# Altium project EPROM_Programmer.PrjPcb
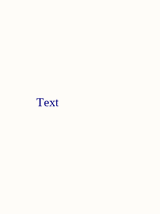
[diagram p0: EPROM_Programmer.SchDoc, left]
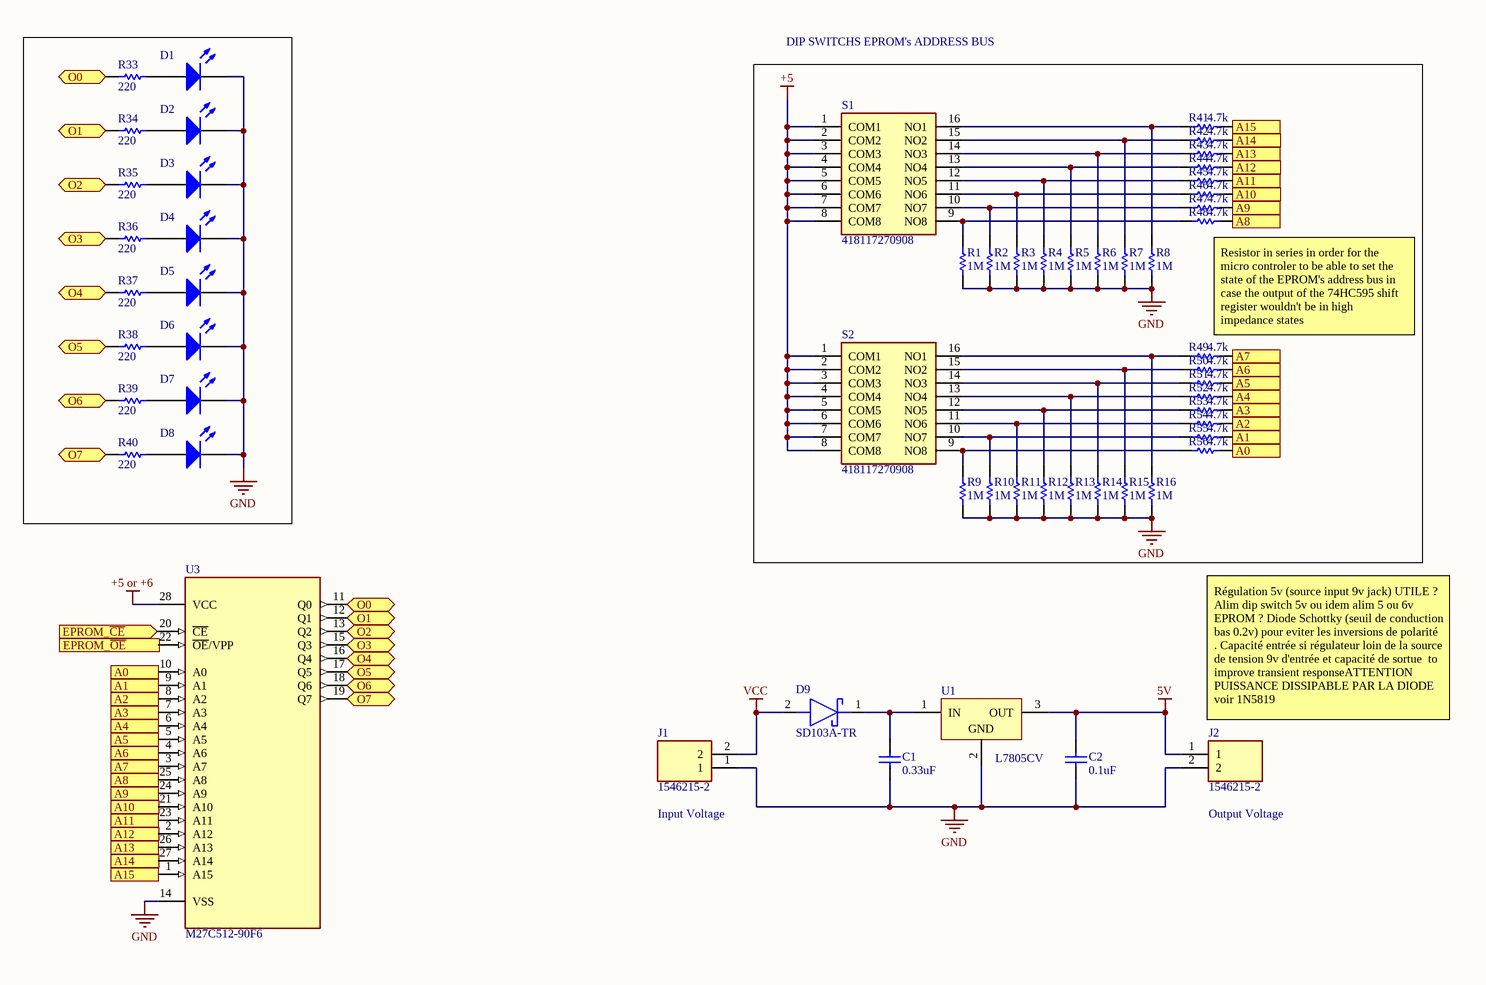
[diagram p1: EPROM_Programmer.SchDoc, right]
3 sheets, 109 parts. Net scope: flat (ports and power ports of the same name join across sheets).
Board file: EPROM_Programmer.PcbDoc
Sheets:
  EPROM_Programmer.SchDoc
  EPROM_Programmer_2.SchDoc
  EPROM_Programmer_3.SchDoc

## Sheet EPROM_Programmer.SchDoc: EPROM MANUAL PROGRAMMER
size A4; Author: L.JAOUANNE; Revision: v1.0; SheetNumber: 1; SheetTotal: 3

### Parts
C1  0.33uF  [C0603]
C2  0.1uF  [C0603]
D1  LED_SMD  [0603_LED]  (value not drawn)
D2  LED_SMD  [0603_LED]  (value not drawn)
D3  LED_SMD  [0603_LED]  (value not drawn)
D4  LED_SMD  [0603_LED]  (value not drawn)
D5  LED_SMD  [0603_LED]  (value not drawn)
D6  LED_SMD  [0603_LED]  (value not drawn)
D7  LED_SMD  [0603_LED]  (value not drawn)
D8  LED_SMD  [0603_LED]  (value not drawn)
D9  SD103A-TR  [DIOAD950W60L350D150]
J1  1546215-2  [15462152]
J2  1546215-2  [15462152]
R1  value 1M  [R0603]  (hidden comment: Res1)
R2  value 1M  [R0603]  (hidden comment: Res1)
R3  value 1M  [R0603]  (hidden comment: Res1)
R4  value 1M  [R0603]  (hidden comment: Res1)
R5  value 1M  [R0603]  (hidden comment: Res1)
R6  value 1M  [R0603]  (hidden comment: Res1)
R7  value 1M  [R0603]  (hidden comment: Res1)
R8  value 1M  [R0603]  (hidden comment: Res1)
R9  value 1M  [R0603]  (hidden comment: Res1)
R10  value 1M  [R0603]  (hidden comment: Res1)
R11  value 1M  [R0603]  (hidden comment: Res1)
R12  value 1M  [R0603]  (hidden comment: Res1)
R13  value 1M  [R0603]  (hidden comment: Res1)
R14  value 1M  [R0603]  (hidden comment: Res1)
R15  value 1M  [R0603]  (hidden comment: Res1)
R16  value 1M  [R0603]  (hidden comment: Res1)
R33  value 220  [R0603]  (hidden comment: Res1)
R34  value 220  [R0603]  (hidden comment: Res1)
R35  value 220  [R0603]  (hidden comment: Res1)
R36  value 220  [R0603]  (hidden comment: Res1)
R37  value 220  [R0603]  (hidden comment: Res1)
R38  value 220  [R0603]  (hidden comment: Res1)
R39  value 220  [R0603]  (hidden comment: Res1)
R40  value 220  [R0603]  (hidden comment: Res1)
R41  value 4.7k  [R0603]  (hidden comment: Res1)
R42  value 4.7k  [R0603]  (hidden comment: Res1)
R43  value 4.7k  [R0603]  (hidden comment: Res1)
R44  value 4.7k  [R0603]  (hidden comment: Res1)
R45  value 4.7k  [R0603]  (hidden comment: Res1)
R46  value 4.7k  [R0603]  (hidden comment: Res1)
R47  value 4.7k  [R0603]  (hidden comment: Res1)
R48  value 4.7k  [R0603]  (hidden comment: Res1)
R49  value 4.7k  [R0603]  (hidden comment: Res1)
R50  value 4.7k  [R0603]  (hidden comment: Res1)
R51  value 4.7k  [R0603]  (hidden comment: Res1)
R52  value 4.7k  [R0603]  (hidden comment: Res1)
R53  value 4.7k  [R0603]  (hidden comment: Res1)
R54  value 4.7k  [R0603]  (hidden comment: Res1)
R55  value 4.7k  [R0603]  (hidden comment: Res1)
R56  value 4.7k  [R0603]  (hidden comment: Res1)
S1  418117270908  [DIPS762W60P254L2132H695Q16N]
S2  418117270908  [DIPS762W60P254L2132H695Q16N]
U1  L7805CV  [TO254P1054X470X1955-3]
U3  M27C512-90F6  [DIP254P1524X572-28]

### Blocks framed on the sheet
DIP SWITCHS EPROM's ADDRESS BUS: R1-R16 R41-R56 S1 S2

### Ports
A0 (in, see EPROM_Programmer[4B], EPROM_Programmer_3[1C]), A0 (out, see EPROM_Programmer[1C], EPROM_Programmer_3[1C]), A1 (in, see EPROM_Programmer[4B], EPROM_Programmer_3[1C]), A1 (out, see EPROM_Programmer[1C], EPROM_Programmer_3[1C]), A2 (in, see EPROM_Programmer[4B], EPROM_Programmer_3[1C]), A2 (out, see EPROM_Programmer[1C], EPROM_Programmer_3[1C]), A3 (in, see EPROM_Programmer[4B], EPROM_Programmer_3[1C]), A3 (out, see EPROM_Programmer[1C], EPROM_Programmer_3[1C]), A4 (in, see EPROM_Programmer[4B], EPROM_Programmer_3[1C]), A4 (out, see EPROM_Programmer[1C], EPROM_Programmer_3[1C]), A5 (in, see EPROM_Programmer[4B], EPROM_Programmer_3[1C]), A5 (out, see EPROM_Programmer[1C], EPROM_Programmer_3[1C]), A6 (in, see EPROM_Programmer[4B], EPROM_Programmer_3[1C]), A6 (out, see EPROM_Programmer[1D], EPROM_Programmer_3[1C]), A7 (in, see EPROM_Programmer[4B], EPROM_Programmer_3[1C]), A7 (out, see EPROM_Programmer[1D], EPROM_Programmer_3[1C]), A8 (in, see EPROM_Programmer[4A], EPROM_Programmer_3[2D]), A8 (out, see EPROM_Programmer[1D], EPROM_Programmer_3[2D]), A9 (in, see EPROM_Programmer[4A], EPROM_Programmer_3[1D]), A9 (out, see EPROM_Programmer[1D], EPROM_Programmer_3[1D]), A10 (in, see EPROM_Programmer[4A], EPROM_Programmer_3[1D]), A10 (out, see EPROM_Programmer[1D], EPROM_Programmer_3[1D]), A11 (in, see EPROM_Programmer[4A], EPROM_Programmer_3[1D]), A11 (out, see EPROM_Programmer[1D], EPROM_Programmer_3[1D]), A12 (in, see EPROM_Programmer[4A], EPROM_Programmer_3[1D]), A12 (out, see EPROM_Programmer[1D], EPROM_Programmer_3[1D]), A13 (in, see EPROM_Programmer[4A], EPROM_Programmer_3[1D]), A13 (out, see EPROM_Programmer[1D], EPROM_Programmer_3[1D]), A14 (in, see EPROM_Programmer[4A], EPROM_Programmer_3[1D]), A14 (out, see EPROM_Programmer[1D], EPROM_Programmer_3[1D]), A15 (in, see EPROM_Programmer[4A], EPROM_Programmer_3[1D]), A15 (out, see EPROM_Programmer[1D], EPROM_Programmer_3[1D]), EPROM_~{CE} (in, see EPROM_Programmer_2[4B]), EPROM_~{OE} (in, see EPROM_Programmer_3[4A]), O0 (bidir, see EPROM_Programmer[1A]), O0 (bidir, see EPROM_Programmer[2C]), O1 (bidir, see EPROM_Programmer[1A]), O1 (bidir, see EPROM_Programmer[2C]), O2 (bidir, see EPROM_Programmer[1A]), O2 (bidir, see EPROM_Programmer[2C]), O3 (bidir, see EPROM_Programmer[1A]), O3 (bidir, see EPROM_Programmer[2C]), O4 (bidir, see EPROM_Programmer[1B]), O4 (bidir, see EPROM_Programmer[2C]), O5 (bidir, see EPROM_Programmer[1B]), O5 (bidir, see EPROM_Programmer[2C]), O6 (bidir, see EPROM_Programmer[1B]), O6 (bidir, see EPROM_Programmer[2C]), O7 (bidir, see EPROM_Programmer[1B]), O7 (bidir, see EPROM_Programmer[2C])

### Nets
5V: C2.1 J2.1 U1.3(OUT)
+5: C1.2 C2.2 D1.2(K) D2.2(K) D3.2(K) D4.2(K) D5.2(K) D6.2(K) D7.2(K) D8.2(K) J1.1 J2.2 R1.2 R2.2 R3.2 R4.2 R5.2 R6.2 R7.2 R8.2 R9.2 R10.2 R11.2 R12.2 R13.2 R14.2 R15.2 R16.2 S1.1(COM1) S1.2(COM2) S1.3(COM3) S1.4(COM4) S1.5(COM5) S1.6(COM6) S1.7(COM7) S1.8(COM8) S2.1(COM1) S2.2(COM2) S2.3(COM3) S2.4(COM4) S2.5(COM5) S2.6(COM6) S2.7(COM7) S2.8(COM8) U1.2(GND) U3.14(VSS)  [also labelled GND]
+5 or +6: U3.28(VCC)
VCC: D9.2(A) J1.2
NetC1_1: C1.1 D9.1(K) U1.1(IN)
NetD1_1: D1.1(A) R33.1
NetD2_1: D2.1(A) R34.1
NetD3_1: D3.1(A) R35.1
NetD4_1: D4.1(A) R36.1
NetD5_1: D5.1(A) R37.1
NetD6_1: D6.1(A) R38.1
NetD7_1: D7.1(A) R39.1
NetD8_1: D8.1(A) R40.1
NetIC2_1: R55.2 U3.9(A1) ; port A1
NetIC2_2: R54.2 U3.8(A2) ; port A2
NetIC2_3: R53.2 U3.7(A3) ; port A3
NetIC2_4: R52.2 U3.6(A4) ; port A4
NetIC2_5: R51.2 U3.5(A5) ; port A5
NetIC2_6: R50.2 U3.4(A6) ; port A6
NetIC2_7: R49.2 U3.3(A7) ; port A7
NetIC2_15: R56.2 U3.10(A0) ; port A0
NetIC3_1: R47.2 U3.24(A9) ; port A9
NetIC3_2: R46.2 U3.21(A10) ; port A10
NetIC3_3: R45.2 U3.23(A11) ; port A11
NetIC3_4: R44.2 U3.2(A12) ; port A12
NetIC3_5: R43.2 U3.26(A13) ; port A13
NetIC3_6: R42.2 U3.27(A14) ; port A14
NetIC3_7: R41.2 U3.1(A15) ; port A15
NetIC3_15: R48.2 U3.25(A8) ; port A8
NetR1_1: R1.1 R48.1 S1.9(NO8)
NetR2_1: R2.1 R47.1 S1.10(NO7)
NetR3_1: R3.1 R46.1 S1.11(NO6)
NetR4_1: R4.1 R45.1 S1.12(NO5)
NetR5_1: R5.1 R44.1 S1.13(NO4)
NetR6_1: R6.1 R43.1 S1.14(NO3)
NetR7_1: R7.1 R42.1 S1.15(NO2)
NetR8_1: R8.1 R41.1 S1.16(NO1)
NetR9_1: R9.1 R56.1 S2.9(NO8)
NetR10_1: R10.1 R55.1 S2.10(NO7)
NetR11_1: R11.1 R54.1 S2.11(NO6)
NetR12_1: R12.1 R53.1 S2.12(NO5)
NetR13_1: R13.1 R52.1 S2.13(NO4)
NetR14_1: R14.1 R51.1 S2.14(NO3)
NetR15_1: R15.1 R50.1 S2.15(NO2)
NetR16_1: R16.1 R49.1 S2.16(NO1)
NetR33_2: R33.2 U3.11(Q0) ; port O0
NetR34_2: R34.2 U3.12(Q1) ; port O1
NetR35_2: R35.2 U3.13(Q2) ; port O2
NetR36_2: R36.2 U3.15(Q3) ; port O3
NetR37_2: R37.2 U3.16(Q4) ; port O4
NetR38_2: R38.2 U3.17(Q5) ; port O5
NetR39_2: R39.2 U3.18(Q6) ; port O6
NetR40_2: R40.2 U3.19(Q7) ; port O7
NetU3_20: U3.20(~{CE}) ; port EPROM_~{CE}

Not connected (* = marked no-connect by the designer): U3 22(~{OE}/VPP)

### Notes on the sheet
- Text
- Resistor in series in order for the micro controler to be able to set the state of the EPROM's address bus in case the output of the 74HC595 shift register wouldn't be in high impedance states
- (near J2) Régulation 5v (source input 9v jack) UTILE ? Alim dip switch 5v ou idem alim 5 ou 6v EPROM ? Diode Schottky (seuil de conduction bas 0.2v) pour eviter les inversions de polarité . Capacité entrée si régulateur loin de la source de tension 9v d'entrée et capacité de sortue  to improve transient responseATTENTION PUISSANCE DISSIPABLE PAR LA DIODE voir 1N5819
- (near J1) Input Voltage
- (near J2) Output Voltage

### Library data of the parts
C1 C2 = Cap: Capacitor; Value: 100pF; PackageReference: RAD-0.3; PackageDescription: Radial Cap, Thru-Hole; 2 Leads; 0.3 in Pin Spacing
D1-D8 = LED_SMD: LED RED CLEAR 0603 SMD; Manufacturer Part Number: LTST-C191KRKT; PackageReference: 0603 (1608 Metric); PackageDescription: 1.60mm L x 0.80mm W; Digikey Part Number: 160-1447-1-ND; Value: RED
D9 = SD103A-TR: Schottky Diode; Manufacturer_Name: Vishay; Datasheet Link: https://componentsearchengine.com/Datasheets/5/SD103A-TR.pdf; Manufacturer_Part_Number: SD103A-TR; Mouser Part Number: 625-SD103A; Mouser Price/Stock: https://www.mouser.co.uk/ProductDetail/Vishay-Semiconductors/SD103A-TR?qs=RwahMLkpD2urFD%2FzZdGOBw%3D%3D; Arrow Part Number: SD103A-TR; Arrow Price/Stock: https://www.arrow.com/en/products/sd103a-tr/vishay?region=nac
J1 J2 = 1546215-2: Connector; Manufacturer_Name: TE Connectivity; Datasheet Link: https://www.te.com/commerce/DocumentDelivery/DDEController?Action=srchrtrv&DocNm=1-1773458-1_EURO_STYLE_QRG&DocType=Data%20Sheet&DocLang=English&PartCntxt=1546215-2&DocFormat=pdf; Height: 10.3mm; Manufacturer_Part_Number: 1546215-2; Mouser Part Number: 571-1546215-2; Mouser Price/Stock: https://www.mouser.co.uk/ProductDetail/TE-Connectivity/1546215-2?qs=Lxq28tKK6BPmJFoAOY7Ljw%3D%3D; Arrow Part Number: 1546215-2; Arrow Price/Stock: https://www.arrow.com/en/products/1546215-2/te-connectivity?region=nac
R1-R16 R33-R56 = Res1: Resistor; PackageReference: AXIAL-0.3; PackageDescription: Axial Device, Thru-Hole; 2 Leads; 0.3 in Pin Spacing
S1 S2 = 418117270908: Switch; Manufacturer_Name: Wurth Elektronik; Datasheet Link: https://www.we-online.com/catalog/datasheet/418117270908.pdf; Height: 6.95mm; Manufacturer_Part_Number: 418117270908; Mouser Part Number: 710-418117270908; Mouser Price/Stock: https://www.mouser.co.uk/ProductDetail/Wurth-Elektronik/418117270908?qs=wr8lucFkNMXJyYOZ9v4znw%3D%3D
U1 = CMP-0244-00483-1: Positive Voltage Regulator, 5V, 3-Pin TO-220; PackageDescription: TO, Thru-Hole, Vertical, Heatsink Mounted; 3 In-Line Leads; Pitch 2.54 mm; ComponentLink2Description: Datasheet; PackageReference: TO220; ComponentLink3URL: http://www.st.com/internet/com/TECHNICAL_RESOURCES/TECHNICAL_LITERATURE/PACKAGE_INFORMATION/CD00004649.pdf; DatasheetVersion: 16/11/2011; ComponentLink1Description: Manufacturer URL; ComponentLink1URL: http://www.st.com; PackageVersion: ver3.0; ComponentLink3Description: Package Specification; ComponentLink2URL: http://www.st.com/internet/com/TECHNICAL_RESOURCES/TECHNICAL_LITERATURE/DATASHEET/CD00000444.pdf
U3 = M27C512-90F6: EPROM - UV Memory IC 512Kb (64K x 8) Parallel 90 ns 28-CDIP Frit Seal with Window; MF: STMicroelectronics; SnapEDA_Link: https://www.snapeda.com/parts/M27C512-90F6/STMicroelectronics/view-part/?ref=snap; Package: CDIP-28 STMicroelectronics; Value: *; MP: M27C512-90F6; Check_prices: https://www.snapeda.com/parts/M27C512-90F6/STMicroelectronics/view-part/?ref=eda

## Sheet EPROM_Programmer_2.SchDoc: EPROM MANUAL PROGRAMMER 2
size A4; Author: L.JAOUANNE; Revision: v1.0; SheetNumber: 2; SheetTotal: 3
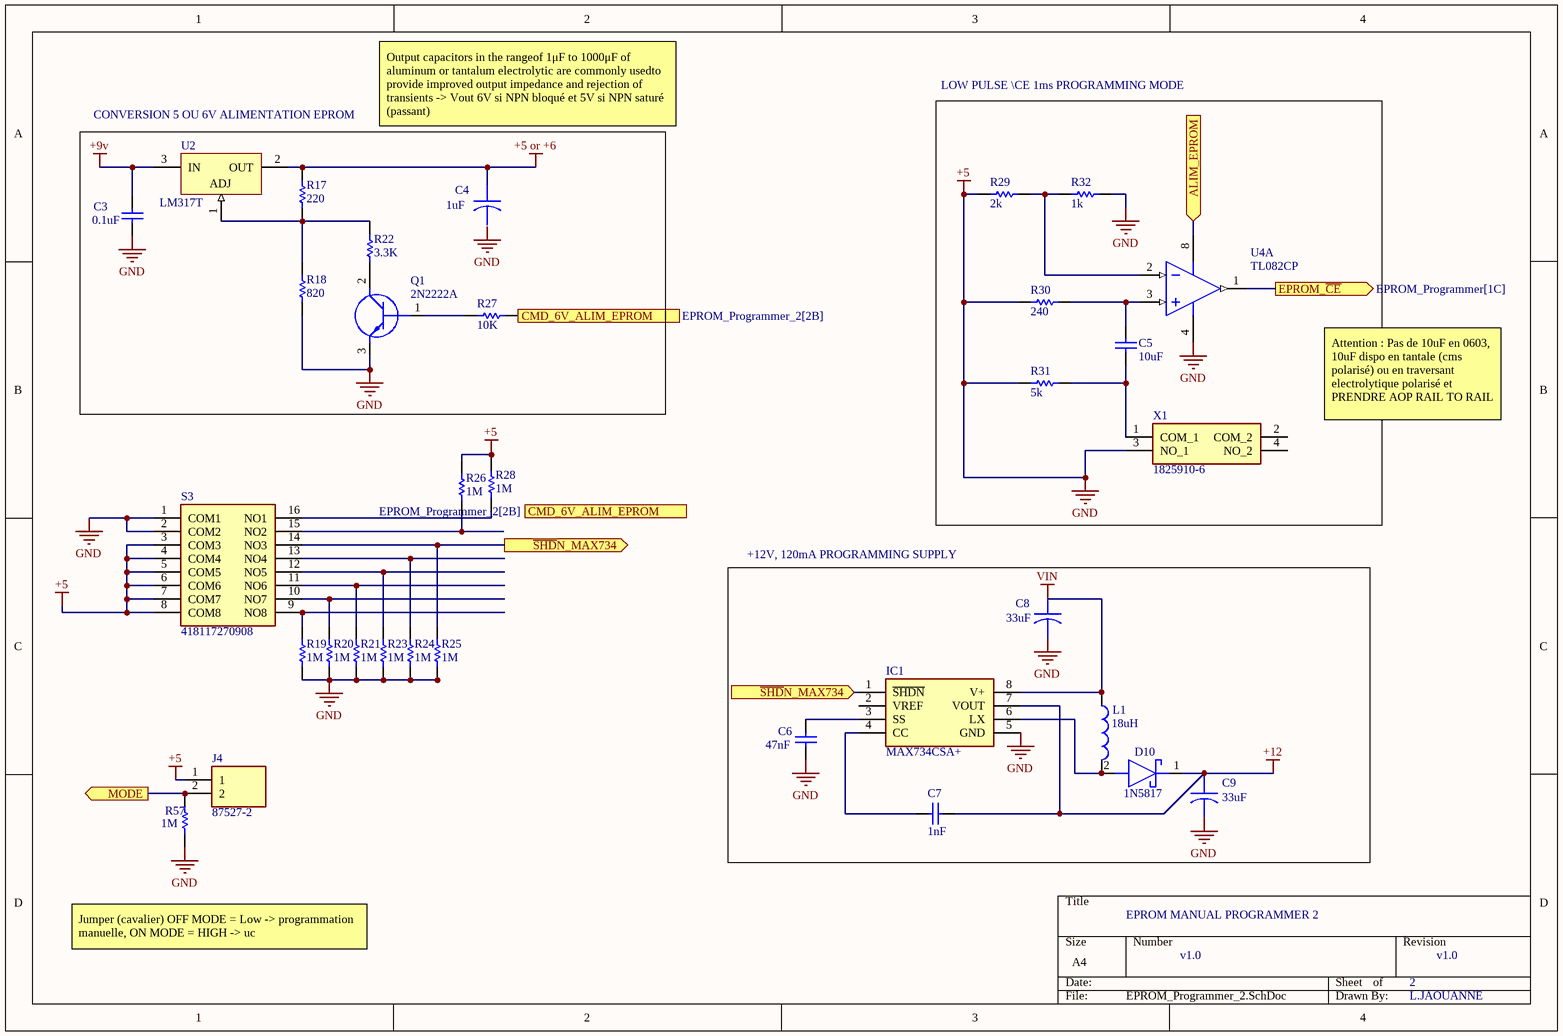
[diagram p2: EPROM_Programmer_2.SchDoc]

### Parts
C3  0.1uF  [C0603]
C4  1uF  [CAPPRD200W50D550H1250]
C5  10uF  [C0603]
C6  47nF  [C0603]
C7  1nF  [C0603]
C8  33uF  [CAPPRD200W50D550H1250]
C9  33uF  [CAPPRD200W50D550H1250]
D10  1N5817  [DIOAD950W60L350D150]
IC1  MAX734CSA+  [SOIC127P600X175-8N]
J4  87527-2  [HDRV2W66P0X254_1X2_467X244X1044P]
L1  value 18uH  [2029]  (hidden comment: Inductor)
Q1  2N2222A  [TO-18_4]
R17  value 220  [R0603]  (hidden comment: Res1)
R18  value 820  [R0603]  (hidden comment: Res1)
R19  value 1M  [R0603]  (hidden comment: Res1)
R20  value 1M  [R0603]  (hidden comment: Res1)
R21  value 1M  [R0603]  (hidden comment: Res1)
R22  value 3.3K  [R0603]  (hidden comment: Res1)
R23  value 1M  [R0603]  (hidden comment: Res1)
R24  value 1M  [R0603]  (hidden comment: Res1)
R25  value 1M  [R0603]  (hidden comment: Res1)
R26  value 1M  [R0603]  (hidden comment: Res1)
R27  value 10K  [R0603]  (hidden comment: Res1)
R28  value 1M  [R0603]  (hidden comment: Res1)
R29  value 2k  [R0603]  (hidden comment: Res1)
R30  value 240  [R0603]  (hidden comment: Res1)
R31  value 5k  [R0603]  (hidden comment: Res1)
R32  value 1k  [R0603]  (hidden comment: Res1)
R57  value 1M  [R0603]  (hidden comment: Res1)
S3  418117270908  [DIPS762W60P254L2132H695Q16N]
U2  LM317T  [TO254P1054X470X1955-3]
U4  TL082CP  [P0008A]  (part A of 2)
X1  1825910-6  [18259106]

### Blocks framed on the sheet
CONVERSION 5 OU 6V ALIMENTATION EPROM: C3 C4 Q1 R17 R18 R22 R27 U2
LOW PULSE \CE 1ms PROGRAMMING MODE: C5 R29-R32 U4 X1
+12V, 120mA PROGRAMMING SUPPLY: C6-C9 D10 IC1 L1

### Ports
ALIM_EPROM (in), CMD_6V_ALIM_EPROM (in, see EPROM_Programmer_2[2B]), CMD_6V_ALIM_EPROM (out, see EPROM_Programmer_2[2B]), EPROM_~{CE} (out, see EPROM_Programmer[1C]), MODE (out), ~{SHD}N_MAX734 (in, see EPROM_Programmer_2[2C]), ~{SHD}N_MAX734 (out, see EPROM_Programmer_2[2C])

### Nets
+5: C3.2 C6.2 C8.2 C9.2 IC1.5(GND) J4.1 Q1.3(E) R18.2 R19.2 R20.2 R21.2 R23.2 R24.2 R25.2 R26.1 R28.1 R29.2 R30.2 R31.2 R32.1 R57.2 S3.1(COM1) S3.2(COM2) S3.3(COM3) S3.4(COM4) S3.5(COM5) S3.6(COM6) S3.7(COM7) S3.8(COM8) U4.4(VCC-) X1.3(NO_1)  [also labelled GND]
+5 or +6: C4.1 R17.2 U2.2(OUT)
+9v: C3.1 U2.3(IN)
+12: C7.2 C9.1 D10.1(K) IC1.7(VOUT)
VIN: C8.1
NetC5_1: C5.1 R30.1 U4.3(IN1+)
NetC5_2: C5.2 R31.1 X1.1(COM_1)
NetC6_1: C6.1 IC1.3(SS)
NetC7_1: C7.1 IC1.4(CC)
NetD10_2: D10.2(A) IC1.6(LX) L1.2
NetIC1_1: IC1.1(~{SHDN}) R25.1 S3.14(NO3) ; port ~{SHD}N_MAX734
NetIC1_8: IC1.8(V+) L1.1
NetJ4_2: J4.2 R57.1 ; port MODE
NetQ1_1: Q1.1(B) R27.2
NetQ1_2: Q1.2(C) R22.2
NetR17_1: R17.1 R18.1 R22.1 U2.1(ADJ)
NetR19_1: R19.1 S3.9(NO8)
NetR20_1: R20.1 S3.10(NO7)
NetR21_1: R21.1 S3.11(NO6)
NetR23_1: R23.1 S3.12(NO5)
NetR24_1: R24.1 S3.13(NO4)
NetR26_2: R26.2 S3.15(NO2)
NetR27_1: R27.1 ; port CMD_6V_ALIM_EPROM
NetR28_2: R28.2 S3.16(NO1)
NetR29_1: R29.1 R32.2 U4.2(IN1-)
NetU3_20: U4.1(OUT1) ; port EPROM_~{CE}
NetU4_8: U4.8(VCC+) ; port ALIM_EPROM

Not connected (* = marked no-connect by the designer): C4 2; IC1 2(VREF); X1 2(COM_2) 4(NO_2)

### Notes on the sheet
- Output capacitors in the rangeof 1μF to 1000μF of aluminum or tantalum electrolytic are commonly usedto provide improved output impedance and rejection of transients -> Vout 6V si NPN bloqué et 5V si NPN saturé (passant)
- Attention : Pas de 10uF en 0603, 10uF dispo en tantale (cms polarisé) ou en traversant electrolytique polarisé et PRENDRE AOP RAIL TO RAIL
- Jumper (cavalier) OFF MODE = Low -> programmation manuelle, ON MODE = HIGH -> uc
- Labels drawn without touching a wire or pin: GND

### Library data of the parts
C3 C5-C7 = Cap: Capacitor; Value: 100pF; PackageReference: RAD-0.3; PackageDescription: Radial Cap, Thru-Hole; 2 Leads; 0.3 in Pin Spacing
C4 C8 C9 = UVR1C330MDD: 33ÂµF 16V Aluminum Electrolytic Capacitors Radial, Can 2000 Hrs @ 85Â°C; MF: Nichicon; Availability: Good; MP: UVR1C330MDD; Package: Radial Nichicon; SnapEDA_Link: https://www.snapeda.com/parts/UVR1C330MDD/Nichicon/view-part/859142/?ref=snap; Purchase-URL: https://pricing.snapeda.com/search/part/UVR1C330MDD/?ref=eda; Check_prices: https://www.snapeda.com/parts/UVR1C330MDD/Nichicon/view-part/859142/?ref=eda; Value: *; Price: None
D10 = SD103A-TR: as D9 on sheet EPROM_Programmer; Datasheet Link: https://componentsearchengine.com/Datasheets/5/SD103A-TR.pdf; Manufacturer_Part_Number: SD103A-TR; Mouser Part Number: 625-SD103A; Mouser Price/Stock: https://www.mouser.co.uk/ProductDetail/Vishay-Semiconductors/SD103A-TR?qs=RwahMLkpD2urFD%2FzZdGOBw%3D%3D; Arrow Part Number: SD103A-TR; Arrow Price/Stock: https://www.arrow.com/en/products/sd103a-tr/vishay?region=nac
IC1 = MAX734CSA+: Integrated Circuit; Manufacturer_Name: Analog Devices; Datasheet Link: https://datasheets.maximintegrated.com/en/ds/MAX734.pdf; Height: 1.75mm; Manufacturer_Part_Number: MAX734CSA+; Mouser Part Number: 700-MAX734CSA; Mouser Price/Stock: https://www.mouser.co.uk/ProductDetail/Analog-Devices-Maxim-Integrated/MAX734CSA%2b?qs=1THa7WoU59E%252BWIOpGpIp2A%3D%3D; Arrow Part Number: MAX734CSA+; Arrow Price/Stock: https://www.arrow.com/en/products/max734csa/analog-devices?region=europe
J4 = 87527-2: Connector Embases et logements de câbles HEADER 2 POS; Manufacturer_Name: TE Connectivity; Datasheet Link: https://www.te.com/commerce/DocumentDelivery/DDEController?Action=showdoc&DocId=Customer+Drawing%7F87527%7FH%7Fpdf%7FEnglish%7FENG_CD_87527_H.pdf%7F87527-2; Height: 10.439mm; Manufacturer_Part_Number: 87527-2; Mouser Part Number: 571-875272; Mouser Price/Stock: https://www.mouser.co.uk/ProductDetail/TE-Connectivity/87527-2?qs=ZDXmSm13593hsB4j%252B6gMfg%3D%3D; Arrow Part Number: 87527-2; Arrow Price/Stock: https://www.arrow.com/en/products/87527-2/te-connectivity?region=nac
Q1 = 2N2222A: Transistor BJT NPN; Manufacturer_Name: STMicroelectronics; Datasheet Link: https://datasheet.datasheetarchive.com/originals/distributors/Datasheets-25/DSA-481035.pdf; Manufacturer_Part_Number: 2N2222A; Mouser Part Number: 511-2N2222A; Mouser Price/Stock: https://www.mouser.co.uk/ProductDetail/STMicroelectronics/2N2222A?qs=UMEuL5FsraBzcgM1cdcH3A%3D%3D
R17-R32 R57 = Res1: Resistor; PackageReference: AXIAL-0.3; PackageDescription: Axial Device, Thru-Hole; 2 Leads; 0.3 in Pin Spacing
S3 = 418117270908: as S1 on sheet EPROM_Programmer; Datasheet Link: https://www.we-online.com/catalog/datasheet/418117270908.pdf; Height: 6.95mm; Manufacturer_Part_Number: 418117270908; Mouser Part Number: 710-418117270908; Mouser Price/Stock: https://www.mouser.co.uk/ProductDetail/Wurth-Elektronik/418117270908?qs=wr8lucFkNMXJyYOZ9v4znw%3D%3D
U2 = CMP-0244-00444-1: 1.5A, 1.2V to 37V Adjustable Voltage Regulator, 3-Pin TO-220; PackageVersion: 2011; ComponentLink1URL: http://www.st.com; ComponentLink2URL: http://www.st.com/internet/com/TECHNICAL_RESOURCES/TECHNICAL_LITERATURE/DATASHEET/CD00000455.pdf; PackageDescription: TO, Thru-Hole, Vertical, Heatsink Mounted; 3 In-Line Leads; Pitch 2.54 mm; PackageReference: TO-220; ComponentLink1Description: Manufacturer URL; ComponentLink3URL: http://www.st.com/internet/com/TECHNICAL_RESOURCES/TECHNICAL_LITERATURE/PACKAGE_INFORMATION/CD00004649.pdf; DatasheetVersion: 1/11/2011; ComponentLink2Description: Datasheet; ComponentLink3Description: Package Specification
U4 = CMP-0055-00158-5: JFET-Input Operational Amplifier, 7 to 36 V, 0 to 70 degC, 8-pin DIP (P8), Pb-Free (RoHS); Manufacturer: Texas Instruments; Total Supply Voltage(Max)(+5V is 5, +/-5V is 10): 36; Rating: Catalog; Number of Channels: 2; Slew Rate(Typ)(V/us): 13; CMRR(Min)(dB): 70; Sub Family: General Purpose Amplifier, High Supply Voltage Amplifier (>=30V); Offset Drift(Typ)(uV/C): 18; Total Supply Voltage(Min)(+5V is 5, +/-5V is 10): 7; IIB(Max)(pA): 400; GBW(Typ)(MHz): 3; Iq per channel(Max)(mA): 2.8; Vio (25C)(Max)(mV): 15; PackageDescription: 8-Pin Plastic In-Line, Body 9.59 x 6.35 mm, Pitch 2.54 mm; ComponentLink2URL: http://www.ti.com/lit/ds/symlink/tl082.pdf; Mounting Technology: Through Hole; Code_JEDEC: MS-001; ComponentLink1Description: Manufacturer URL; ComponentLink3Description: Package Specification; PartNumber: TL082CP; PackageVersion: 4040082/E, 04/2010; Eco-Plan: Pb-Free (RoHS); ComponentLink1URL: http://www.ti.com/; PackageReference: P0008A; ComponentLink3URL: http://www.ti.com/litv/pdf/mpdi001b; DatasheetVersion: SLOS081G; ComponentLink2Description: Datasheet; Vn at 1kHz(Typ)(nV/rtHz): 18
X1 = 1825910-6: Body Features: Product Orientation Vertical; Manufacturer_Name: TE Connectivity; Geometry.Height: 5.3mm; Manufacturer_Part_Number: 1825910-6; Mouser Part Number: 650-1825910-6; Mouser Price/Stock: https://www.mouser.co.uk/ProductDetail/TE-Connectivity/1825910-6?qs=A6cQTCBcXncisYDS1KbpGA%3D%3D; Arrow Part Number: 1825910-6; Arrow Price/Stock: https://www.arrow.com/en/products/1825910-6/te-connectivity?region=nac; Datasheet Link: https://www.te.com/commerce/DocumentDelivery/DDEController?Action=srchrtrv&DocNm=1308111-1_SWITCHES_CORE_PROGRAM_CATALOG&DocType=Catalog%20Section&DocLang=English&PartCntxt=1825910-6&DocFormat=pdf
L1 = Inductor: PackageReference: 0402-A; PackageDescription: Chip Inductor

## Sheet EPROM_Programmer_3.SchDoc: EPROM PROGRAMMER THROUGH MIICROCONTROLER
size A4; Author: L.JAOUANNE; Revision: v1.0; SheetNumber: 3; SheetTotal: 3
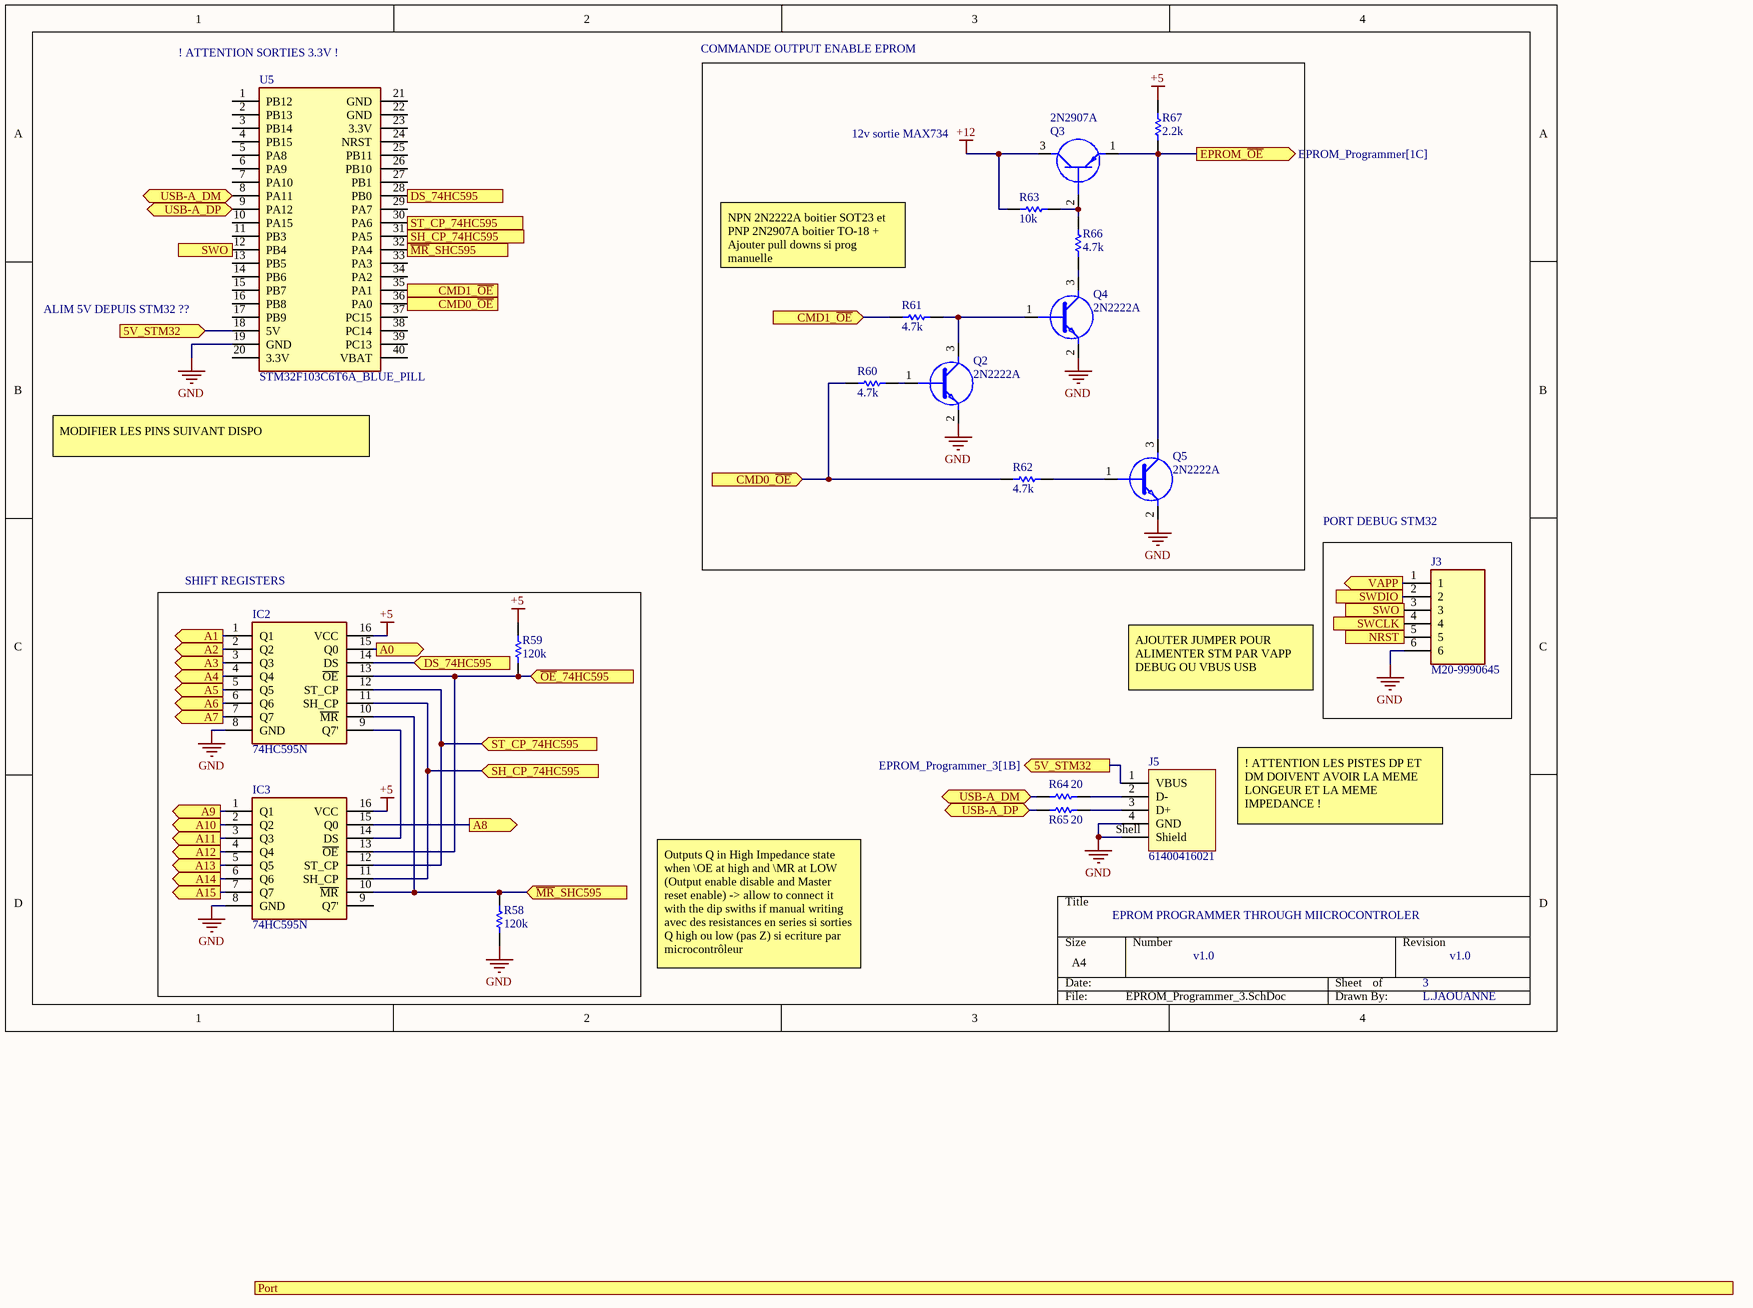
[diagram p3: EPROM_Programmer_3.SchDoc]

### Parts
IC2  74HC595N  [DIP762W53P254L1902H420Q16N]
IC3  74HC595N  [DIP762W53P254L1902H420Q16N]
J3  M20-9990645  [HDRV6W66P0X254_1X6_1524X254X874P]
J5  61400416021  [61400416021]
Q2  2N2222A  [SOT96P237X111-3N]
Q3  2N2907A  [CENTRAL_TO18]
Q4  2N2222A  [SOT96P237X111-3N]
Q5  2N2222A  [SOT96P237X111-3N]
R58  value 120k  [R0603]  (hidden comment: Res1)
R59  value 120k  [R0603]  (hidden comment: Res1)
R60  value 4.7k  [R0603]  (hidden comment: Res1)
R61  value 4.7k  [R0603]  (hidden comment: Res1)
R62  value 4.7k  [R0603]  (hidden comment: Res1)
R63  value 10k  [R0603]  (hidden comment: Res1)
R64  value 20  [R0603]  (hidden comment: Res1)
R65  value 20  [R0603]  (hidden comment: Res1)
R66  value 4.7k  [R0603]  (hidden comment: Res1)
R67  value 2.2k  [R0603]  (hidden comment: Res1)
U5  STM32F103C6T6A_BLUE_PILL  [TE_1-535541-8]

### Blocks framed on the sheet
PORT DEBUG STM32: J3
SHIFT REGISTERS: IC2 IC3 R58 R59

### Ports
5V_STM32 (in, see EPROM_Programmer_3[3C]), 5V_STM32 (out, see EPROM_Programmer_3[1B]), A0 (out, see EPROM_Programmer[1C], EPROM_Programmer[4B]), A1 (out, see EPROM_Programmer[1C], EPROM_Programmer[4B]), A2 (out, see EPROM_Programmer[1C], EPROM_Programmer[4B]), A3 (out, see EPROM_Programmer[1C], EPROM_Programmer[4B]), A4 (out, see EPROM_Programmer[1C], EPROM_Programmer[4B]), A5 (out, see EPROM_Programmer[1C], EPROM_Programmer[4B]), A6 (out, see EPROM_Programmer[1D], EPROM_Programmer[4B]), A7 (out, see EPROM_Programmer[1D], EPROM_Programmer[4B]), A8 (out, see EPROM_Programmer[1D], EPROM_Programmer[4A]), A9 (out, see EPROM_Programmer[1D], EPROM_Programmer[4A]), A10 (out, see EPROM_Programmer[1D], EPROM_Programmer[4A]), A11 (out, see EPROM_Programmer[1D], EPROM_Programmer[4A]), A12 (out, see EPROM_Programmer[1D], EPROM_Programmer[4A]), A13 (out, see EPROM_Programmer[1D], EPROM_Programmer[4A]), A14 (out, see EPROM_Programmer[1D], EPROM_Programmer[4A]), A15 (out, see EPROM_Programmer[1D], EPROM_Programmer[4A]), CMD0_~{OE} (in, see EPROM_Programmer_3[2B]), CMD0_~{OE} (out, see EPROM_Programmer_3[2B]), CMD1_~{OE} (in, see EPROM_Programmer_3[2B]), CMD1_~{OE} (out, see EPROM_Programmer_3[2B]), DS_74HC595 (in, see EPROM_Programmer_3[2A]), DS_74HC595 (out, see EPROM_Programmer_3[2C]), EPROM_~{OE} (out, see EPROM_Programmer[1C]), NRST, Port, SH_CP_74HC595 (in, see EPROM_Programmer_3[2A]), SH_CP_74HC595 (out, see EPROM_Programmer_3[2C]), ST_CP_74HC595 (in, see EPROM_Programmer_3[2A]), ST_CP_74HC595 (out, see EPROM_Programmer_3[2C]), SWCLK (out), SWDIO, SWO (see EPROM_Programmer_3[1A]), SWO (see EPROM_Programmer_3[4C]), USB-A_DM (bidir, see EPROM_Programmer_3[1A]), USB-A_DM (bidir, see EPROM_Programmer_3[3D]), USB-A_DP (bidir, see EPROM_Programmer_3[1A]), USB-A_DP (bidir, see EPROM_Programmer_3[3D]), VAPP (out), ~{MR}_SHC595 (in, see EPROM_Programmer_3[2A]), ~{MR}_SHC595 (out, see EPROM_Programmer_3[2D]), ~{OE}_74HC595 (in)

### Nets
+5: IC2.8(GND) IC2.16(VCC) IC3.8(GND) IC3.16(VCC) J3.6 J5.4(GND) J5.Shell(Shield) Q2.2(E) Q4.2(E) Q5.2(E) R58.2 R59.1 R67.2 U5.19(GND)  [also labelled GND]
+12: Q3.3(C) R63.2
NetIC2_1: IC2.1(Q1) ; port A1
NetIC2_2: IC2.2(Q2) ; port A2
NetIC2_3: IC2.3(Q3) ; port A3
NetIC2_4: IC2.4(Q4) ; port A4
NetIC2_5: IC2.5(Q5) ; port A5
NetIC2_6: IC2.6(Q6) ; port A6
NetIC2_7: IC2.7(Q7) ; port A7
NetIC2_9: IC2.9(Q7') IC3.14(DS)
NetIC2_10: IC2.10(~{MR}) IC3.10(~{MR}) R58.1 U5.32(PA4) ; port ~{MR}_SHC595
NetIC2_11: IC2.11(SH_CP) IC3.11(SH_CP) U5.31(PA5) ; port SH_CP_74HC595
NetIC2_12: IC2.12(ST_CP) IC3.12(ST_CP) U5.30(PA6) ; port ST_CP_74HC595
NetIC2_13: IC2.13(~{OE}) IC3.13(~{OE}) R59.2 ; port ~{OE}_74HC595
NetIC2_14: IC2.14(DS) U5.28(PB0) ; port DS_74HC595
NetIC2_15: IC2.15(Q0) ; port A0
NetIC3_1: IC3.1(Q1) ; port A9
NetIC3_2: IC3.2(Q2) ; port A10
NetIC3_3: IC3.3(Q3) ; port A11
NetIC3_4: IC3.4(Q4) ; port A12
NetIC3_5: IC3.5(Q5) ; port A13
NetIC3_6: IC3.6(Q6) ; port A14
NetIC3_7: IC3.7(Q7) ; port A15
NetIC3_15: IC3.15(Q0) ; port A8
NetJ3_1: J3.1 ; port VAPP
NetJ3_2: J3.2 ; port SWDIO
NetJ3_3: J3.3 U5.12(PB4) ; port SWO
NetJ3_4: J3.4 ; port SWCLK
NetJ3_5: J3.5 ; port NRST
NetJ5_1: J5.1(VBUS) U5.18(5V) ; port 5V_STM32
NetJ5_2: J5.2(D-) R64.2
NetJ5_3: J5.3(D+) R65.2
NetQ2_1: Q2.1(B) R60.1
NetQ2_3: Q2.3(C) Q4.1(B) R61.1
NetQ3_1: Q3.1(E) Q5.3(C) R67.1 ; port EPROM_~{OE}
NetQ3_2: Q3.2(B) R63.1 R66.2
NetQ4_3: Q4.3(C) R66.1
NetQ5_1: Q5.1(B) R62.1
NetR60_2: R60.2 R62.2 U5.36(PA0) ; port CMD0_~{OE}
NetR61_2: R61.2 U5.35(PA1) ; port CMD1_~{OE}
NetR64_1: R64.1 U5.8(PA11) ; port USB-A_DM
NetR65_1: R65.1 U5.9(PA12) ; port USB-A_DP

Not connected (* = marked no-connect by the designer): IC3 9(Q7'); U5 1(PB12) 2(PB13) 3(PB14) 4(PB15) 5(PA8) 6(PA9) 7(PA10) 10(PA15) 11(PB3) 13(PB5) 14(PB6) 15(PB7) 16(PB8) 17(PB9) 20(3.3V) 21(GND) 22(GND) 23(3.3V) 24(NRST) 25(PB11) 26(PB10) 27(PB1) 29(PA7) 33(PA3) 34(PA2) 37(PC15) 38(PC14) 39(PC13) 40(VBAT)

### Notes on the sheet
- (near U5) ! ATTENTION SORTIES 3.3V !
- COMMANDE OUTPUT ENABLE EPROM
- 12v sortie MAX734
- ALIM 5V DEPUIS STM32 ??
- (near R61) NPN 2N2222A boitier SOT23 et PNP 2N2907A boitier TO-18 + Ajouter pull downs si prog manuelle
- MODIFIER LES PINS SUIVANT DISPO
- AJOUTER JUMPER POUR ALIMENTER STM PAR VAPP DEBUG OU VBUS USB
- ! ATTENTION LES PISTES DP ET DM DOIVENT AVOIR LA MEME LONGEUR ET LA MEME IMPEDANCE !
- Outputs Q in High Impedance state when \OE at high and \MR at LOW (Output enable disable and Master reset enable) -> allow to connect it with the dip swiths if manual writing avec des resistances en series si sorties Q high ou low (pas Z) si ecriture par microcontrôleur

### Library data of the parts
IC2 IC3 = 74HC595N: Integrated Circuit; Manufacturer_Name: NXP; Datasheet Link: https://datasheet.datasheetarchive.com/originals/distributors/SFDatasheet-4/sf-00080087.pdf; Height: 4.2mm; Manufacturer_Part_Number: 74HC595N
J3 = M20-9990645: Connector; Manufacturer_Name: Harwin; Datasheet Link: https://cdn.harwin.com/pdfs/M20-999.pdf; Height: 8.74mm; Manufacturer_Part_Number: M20-9990645; Mouser Part Number: 855-M20-9990645; Mouser Price/Stock: https://www.mouser.co.uk/ProductDetail/Harwin/M20-9990645?qs=Jph8NoUxIfWe7BJQOhiVRg%3D%3D
J5 = CMP-1502-03227-2: NexarPartId: 21041530; Contact Resistance: 20mΩ; Gender: Receptacle; Voltage Rating (DC): 30V; Current Rating: 1.5A; Connector Type: USB; Insulation Resistance: 1GΩ; USB Standard: USB 2.0; Number of Contacts: 4; Number of Ports: 1; Width: 14.4mm; REACH SVHC: Unknown; Contact Plating: Gold; Length: 15.8mm; Lead Free: Lead Free; Max Operating Temperature: 105°C; Orientation: Horizontal; Contact Material: Copper; Voltage Rating: 30V; Min Operating Temperature: -40°C; Flammability Rating: UL94 V-0; Color: White; RoHS: Compliant; Number of Pins: 4; Mount: Horizontal, Through Hole; Number of Positions: 4; Operating Supply Voltage: 30V; Insulation Material: PBT; Termination: Solder
Q2 Q4 Q5 = 2N2222A: Boitier SOT23 -v MMBT2222ALT3G; Manufacturer_Name: onsemi; Geometry.Height: 1.11mm; Manufacturer_Part_Number: MMBT2222ALT3G; Mouser Part Number: 863-MMBT2222ALT3G; Mouser Price/Stock: https://www.mouser.co.uk/ProductDetail/onsemi/MMBT2222ALT3G?qs=R2UZ7gjkEjJUeR4kVVA5Qw%3D%3D; Arrow Part Number: MMBT2222ALT3G; Arrow Price/Stock: https://www.arrow.com/en/products/mmbt2222alt3g/on-semiconductor?utm_currency=USD&region=nac; Datasheet Link: http://www.onsemi.com/pub/Collateral/MMBT2222LT1-D.PDF
Q3 = 2N2907A: Transistor BJT PNP; Manufacturer_Name: Central Semiconductor; Datasheet Link: https://www.centralsemi.com/get_document.php?cmp=1&mergetype=pd&mergepath=pd&pdf_id=2n2906.PDF; Manufacturer_Part_Number: 2N2907A; Mouser Part Number: 610-2N2907A; Mouser Price/Stock: https://www.mouser.com/Search/Refine.aspx?Keyword=610-2N2907A
R58-R67 = Res1: Resistor; PackageReference: AXIAL-0.3; PackageDescription: Axial Device, Thru-Hole; 2 Leads; 0.3 in Pin Spacing
U5 = STM32F103_BLUE_PILL

## Nets that join several sheets
+5: EPROM_Programmer (46 pins), EPROM_Programmer_2 (31 pins), EPROM_Programmer_3 (14 pins)
+5 or +6: EPROM_Programmer (U3.28), EPROM_Programmer_2 (C4.1 R17.2 U2.2)
+12: EPROM_Programmer_2 (C7.2 C9.1 D10.1 IC1.7), EPROM_Programmer_3 (Q3.3 R63.2)
NetIC2_1: EPROM_Programmer (R55.2 U3.9), EPROM_Programmer_3 (IC2.1)
NetIC2_2: EPROM_Programmer (R54.2 U3.8), EPROM_Programmer_3 (IC2.2)
NetIC2_3: EPROM_Programmer (R53.2 U3.7), EPROM_Programmer_3 (IC2.3)
NetIC2_4: EPROM_Programmer (R52.2 U3.6), EPROM_Programmer_3 (IC2.4)
NetIC2_5: EPROM_Programmer (R51.2 U3.5), EPROM_Programmer_3 (IC2.5)
NetIC2_6: EPROM_Programmer (R50.2 U3.4), EPROM_Programmer_3 (IC2.6)
NetIC2_7: EPROM_Programmer (R49.2 U3.3), EPROM_Programmer_3 (IC2.7)
NetIC2_15: EPROM_Programmer (R56.2 U3.10), EPROM_Programmer_3 (IC2.15)
NetIC3_1: EPROM_Programmer (R47.2 U3.24), EPROM_Programmer_3 (IC3.1)
NetIC3_2: EPROM_Programmer (R46.2 U3.21), EPROM_Programmer_3 (IC3.2)
NetIC3_3: EPROM_Programmer (R45.2 U3.23), EPROM_Programmer_3 (IC3.3)
NetIC3_4: EPROM_Programmer (R44.2 U3.2), EPROM_Programmer_3 (IC3.4)
NetIC3_5: EPROM_Programmer (R43.2 U3.26), EPROM_Programmer_3 (IC3.5)
NetIC3_6: EPROM_Programmer (R42.2 U3.27), EPROM_Programmer_3 (IC3.6)
NetIC3_7: EPROM_Programmer (R41.2 U3.1), EPROM_Programmer_3 (IC3.7)
NetIC3_15: EPROM_Programmer (R48.2 U3.25), EPROM_Programmer_3 (IC3.15)
NetU3_20: EPROM_Programmer (U3.20), EPROM_Programmer_2 (U4.1)